# Altium schematic sheet SheetA2.SchDoc
size A2
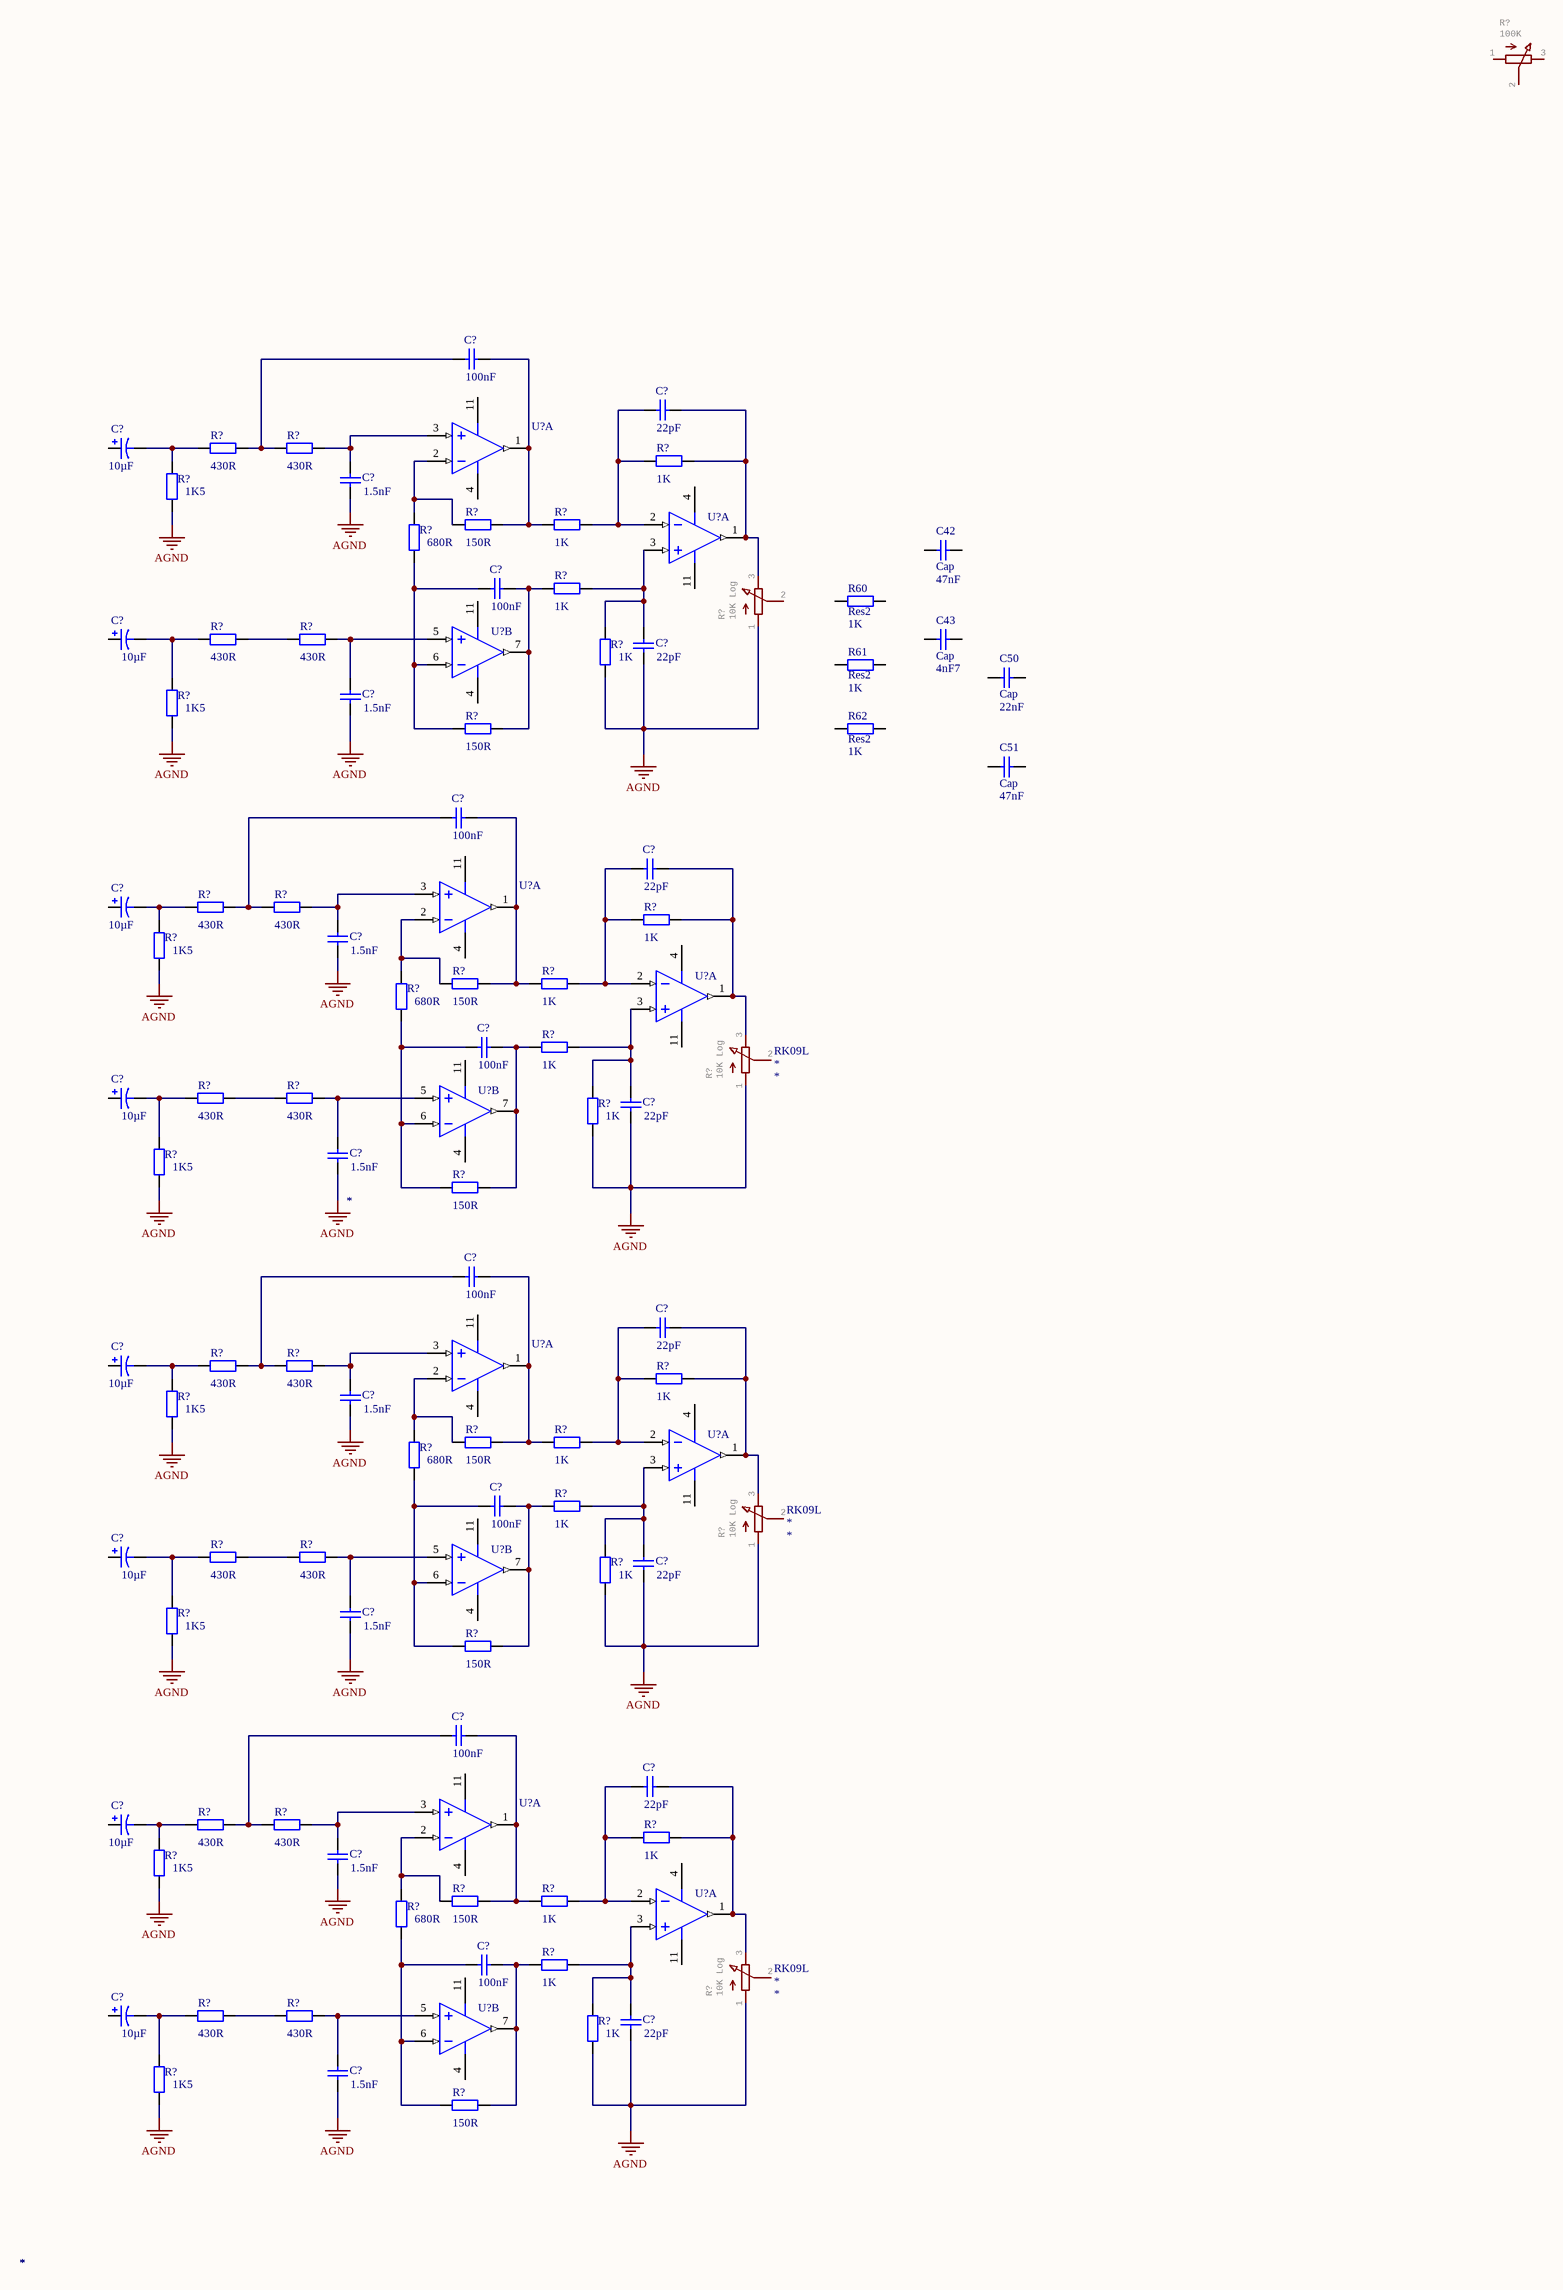
[diagram p0: SheetA2.SchDoc]

## Parts
(Parts that share a designator on the sheet are numbered #1, #2 ... from top to bottom, then left to right.)
C42  Cap  value 47nF  [RAD-0.3]
C43  Cap  value 4nF7  [RAD-0.3]
C50  Cap  value 22nF  [RAD-0.3]
C51  Cap  value 47nF  [RAD-0.3]
C?#1  value 100nF  [RAD-0.3]  (hidden comment: Cap)
C?#2  value 22pF  [RAD-0.3]  (hidden comment: Cap)
C?#3  value 10µF  [RB7.6-15]  (hidden comment: Cap Pol1)
C?#4  value 1.5nF  [RAD-0.3]  (hidden comment: Cap)
C?#5  value 100nF  [RAD-0.3]  (hidden comment: Cap)
C?#6  value 10µF  [RB7.6-15]  (hidden comment: Cap Pol1)
C?#7  value 22pF  [RAD-0.3]  (hidden comment: Cap)
C?#8  value 1.5nF  [RAD-0.3]  (hidden comment: Cap)
C?#9  value 100nF  [RAD-0.3]  (hidden comment: Cap)
C?#10  value 22pF  [RAD-0.3]  (hidden comment: Cap)
C?#11  value 10µF  [RB7.6-15]  (hidden comment: Cap Pol1)
C?#12  value 1.5nF  [RAD-0.3]  (hidden comment: Cap)
C?#13  value 100nF  [RAD-0.3]  (hidden comment: Cap)
C?#14  value 10µF  [RB7.6-15]  (hidden comment: Cap Pol1)
C?#15  value 22pF  [RAD-0.3]  (hidden comment: Cap)
C?#16  value 1.5nF  [RAD-0.3]  (hidden comment: Cap)
C?#17  value 100nF  [RAD-0.3]  (hidden comment: Cap)
C?#18  value 22pF  [RAD-0.3]  (hidden comment: Cap)
C?#19  value 10µF  [RB7.6-15]  (hidden comment: Cap Pol1)
C?#20  value 1.5nF  [RAD-0.3]  (hidden comment: Cap)
C?#21  value 100nF  [RAD-0.3]  (hidden comment: Cap)
C?#22  value 10µF  [RB7.6-15]  (hidden comment: Cap Pol1)
C?#23  value 22pF  [RAD-0.3]  (hidden comment: Cap)
C?#24  value 1.5nF  [RAD-0.3]  (hidden comment: Cap)
C?#25  value 100nF  [RAD-0.3]  (hidden comment: Cap)
C?#26  value 22pF  [RAD-0.3]  (hidden comment: Cap)
C?#27  value 10µF  [RB7.6-15]  (hidden comment: Cap Pol1)
C?#28  value 1.5nF  [RAD-0.3]  (hidden comment: Cap)
C?#29  value 100nF  [RAD-0.3]  (hidden comment: Cap)
C?#30  value 10µF  [RB7.6-15]  (hidden comment: Cap Pol1)
C?#31  value 22pF  [RAD-0.3]  (hidden comment: Cap)
C?#32  value 1.5nF  [RAD-0.3]  (hidden comment: Cap)
R60  Res2  value 1K  [AXIAL-0.4]
R61  Res2  value 1K  [AXIAL-0.4]
R62  Res2  value 1K  [AXIAL-0.4]
R?#1  value 100K  [RK09L1140A5E]
R?#2  value 430R  [AXIAL-0.4]  (hidden comment: Res2)
R?#3  value 430R  [AXIAL-0.4]  (hidden comment: Res2)
R?#4  value 1K  [AXIAL-0.4]  (hidden comment: Res2)
R?#5  value 1K5  [AXIAL-0.4]  (hidden comment: Res2)
R?#6  value 150R  [AXIAL-0.4]  (hidden comment: Res2)
R?#7  value 1K  [AXIAL-0.4]  (hidden comment: Res2)
R?#8  value 680R  [AXIAL-0.4]  (hidden comment: Res2)
R?#9  value 1K  [AXIAL-0.4]  (hidden comment: Res2)
R?#10  value 10K Log  [RK09L1140A5E]
R?#11  value 430R  [AXIAL-0.4]  (hidden comment: Res2)
R?#12  value 430R  [AXIAL-0.4]  (hidden comment: Res2)
R?#13  value 1K  [AXIAL-0.4]  (hidden comment: Res2)
R?#14  value 1K5  [AXIAL-0.4]  (hidden comment: Res2)
R?#15  value 150R  [AXIAL-0.4]  (hidden comment: Res2)
R?#16  value 430R  [AXIAL-0.4]  (hidden comment: Res2)
R?#17  value 430R  [AXIAL-0.4]  (hidden comment: Res2)
R?#18  value 1K  [AXIAL-0.4]  (hidden comment: Res2)
R?#19  value 1K5  [AXIAL-0.4]  (hidden comment: Res2)
R?#20  value 150R  [AXIAL-0.4]  (hidden comment: Res2)
R?#21  value 1K  [AXIAL-0.4]  (hidden comment: Res2)
R?#22  value 680R  [AXIAL-0.4]  (hidden comment: Res2)
R?#23  value 1K  [AXIAL-0.4]  (hidden comment: Res2)
R?#24  value 10K Log  [RK09L1140A5E]
R?#25  value 430R  [AXIAL-0.4]  (hidden comment: Res2)
R?#26  value 430R  [AXIAL-0.4]  (hidden comment: Res2)
R?#27  value 1K  [AXIAL-0.4]  (hidden comment: Res2)
R?#28  value 1K5  [AXIAL-0.4]  (hidden comment: Res2)
R?#29  value 150R  [AXIAL-0.4]  (hidden comment: Res2)
R?#30  value 430R  [AXIAL-0.4]  (hidden comment: Res2)
R?#31  value 430R  [AXIAL-0.4]  (hidden comment: Res2)
R?#32  value 1K  [AXIAL-0.4]  (hidden comment: Res2)
R?#33  value 1K5  [AXIAL-0.4]  (hidden comment: Res2)
R?#34  value 150R  [AXIAL-0.4]  (hidden comment: Res2)
R?#35  value 1K  [AXIAL-0.4]  (hidden comment: Res2)
R?#36  value 680R  [AXIAL-0.4]  (hidden comment: Res2)
R?#37  value 1K  [AXIAL-0.4]  (hidden comment: Res2)
R?#38  value 10K Log  [RK09L1140A5E]
R?#39  value 430R  [AXIAL-0.4]  (hidden comment: Res2)
R?#40  value 430R  [AXIAL-0.4]  (hidden comment: Res2)
R?#41  value 1K  [AXIAL-0.4]  (hidden comment: Res2)
R?#42  value 1K5  [AXIAL-0.4]  (hidden comment: Res2)
R?#43  value 150R  [AXIAL-0.4]  (hidden comment: Res2)
R?#44  value 430R  [AXIAL-0.4]  (hidden comment: Res2)
R?#45  value 430R  [AXIAL-0.4]  (hidden comment: Res2)
R?#46  value 1K  [AXIAL-0.4]  (hidden comment: Res2)
R?#47  value 1K5  [AXIAL-0.4]  (hidden comment: Res2)
R?#48  value 150R  [AXIAL-0.4]  (hidden comment: Res2)
R?#49  value 1K  [AXIAL-0.4]  (hidden comment: Res2)
R?#50  value 680R  [AXIAL-0.4]  (hidden comment: Res2)
R?#51  value 1K  [AXIAL-0.4]  (hidden comment: Res2)
R?#52  value 10K Log  [RK09L1140A5E]
R?#53  value 430R  [AXIAL-0.4]  (hidden comment: Res2)
R?#54  value 430R  [AXIAL-0.4]  (hidden comment: Res2)
R?#55  value 1K  [AXIAL-0.4]  (hidden comment: Res2)
R?#56  value 1K5  [AXIAL-0.4]  (hidden comment: Res2)
R?#57  value 150R  [AXIAL-0.4]  (hidden comment: Res2)
U?#1  OPA1664AIDR  [D0014A_L]  (value not drawn)  (part A of 4)
U?#2  OPA1664AIDR  [D0014A_L]  (value not drawn)  (part A of 4)
U?#3  OPA1664AIDR  [D0014A_L]  (value not drawn)  (part B of 4)
U?#4  OPA1664AIDR  [D0014A_L]  (value not drawn)  (part A of 4)
U?#5  OPA1664AIDR  [D0014A_L]  (value not drawn)  (part A of 4)
U?#6  OPA1664AIDR  [D0014A_L]  (value not drawn)  (part B of 4)
U?#7  OPA1664AIDR  [D0014A_L]  (value not drawn)  (part A of 4)
U?#8  OPA1664AIDR  [D0014A_L]  (value not drawn)  (part A of 4)
U?#9  OPA1664AIDR  [D0014A_L]  (value not drawn)  (part B of 4)
U?#10  OPA1664AIDR  [D0014A_L]  (value not drawn)  (part A of 4)
U?#11  OPA1664AIDR  [D0014A_L]  (value not drawn)  (part A of 4)
U?#12  OPA1664AIDR  [D0014A_L]  (value not drawn)  (part B of 4)

## Nets
AGND: C?#4.1 C?#7.1 C?#8.1 C?#12.1 C?#15.1 C?#16.1 C?#20.1 C?#23.1 C?#24.1 C?#28.1 C?#31.1 C?#32.1 R?#5.1 R?#10.1 R?#13.1 R?#14.1 R?#19.1 R?#24.1 R?#27.1 R?#28.1 R?#33.1 R?#38.1 R?#41.1 R?#42.1 R?#47.1 R?#52.1 R?#55.1 R?#56.1
NetC?#1_1: C?#1.1 R?#2.2 R?#3.1
NetC?#1_2: C?#1.2 R?#6.2 R?#7.1 U?#1.1(OUT_A)
NetC?#2_1: C?#2.1 R?#4.1 R?#7.2 U?#2.2(IN_A-)
NetC?#2_2: C?#2.2 R?#4.2 R?#10.3 U?#2.1(OUT_A)
NetC?#3_2: C?#3.2 R?#2.1 R?#5.2
NetC?#4_2: C?#4.2 R?#3.2 U?#1.3(IN_A+)
NetC?#5_1: C?#5.1 R?#8.1 R?#15.1 U?#3.6(IN_B-)
NetC?#5_2: C?#5.2 R?#9.1 R?#15.2 U?#3.7(OUT_B)
NetC?#6_2: C?#6.2 R?#11.1 R?#14.2
NetC?#7_2: C?#7.2 R?#9.2 R?#13.2 U?#2.3(IN_A+)
NetC?#8_2: C?#8.2 R?#12.2 U?#3.5(IN_B+)
NetC?#9_1: C?#9.1 R?#16.2 R?#17.1
NetC?#9_2: C?#9.2 R?#20.2 R?#21.1 U?#4.1(OUT_A)
NetC?#10_1: C?#10.1 R?#18.1 R?#21.2 U?#5.2(IN_A-)
NetC?#10_2: C?#10.2 R?#18.2 R?#24.3 U?#5.1(OUT_A)
NetC?#11_2: C?#11.2 R?#16.1 R?#19.2
NetC?#12_2: C?#12.2 R?#17.2 U?#4.3(IN_A+)
NetC?#13_1: C?#13.1 R?#22.1 R?#29.1 U?#6.6(IN_B-)
NetC?#13_2: C?#13.2 R?#23.1 R?#29.2 U?#6.7(OUT_B)
NetC?#14_2: C?#14.2 R?#25.1 R?#28.2
NetC?#15_2: C?#15.2 R?#23.2 R?#27.2 U?#5.3(IN_A+)
NetC?#16_2: C?#16.2 R?#26.2 U?#6.5(IN_B+)
NetC?#17_1: C?#17.1 R?#30.2 R?#31.1
NetC?#17_2: C?#17.2 R?#34.2 R?#35.1 U?#7.1(OUT_A)
NetC?#18_1: C?#18.1 R?#32.1 R?#35.2 U?#8.2(IN_A-)
NetC?#18_2: C?#18.2 R?#32.2 R?#38.3 U?#8.1(OUT_A)
NetC?#19_2: C?#19.2 R?#30.1 R?#33.2
NetC?#20_2: C?#20.2 R?#31.2 U?#7.3(IN_A+)
NetC?#21_1: C?#21.1 R?#36.1 R?#43.1 U?#9.6(IN_B-)
NetC?#21_2: C?#21.2 R?#37.1 R?#43.2 U?#9.7(OUT_B)
NetC?#22_2: C?#22.2 R?#39.1 R?#42.2
NetC?#23_2: C?#23.2 R?#37.2 R?#41.2 U?#8.3(IN_A+)
NetC?#24_2: C?#24.2 R?#40.2 U?#9.5(IN_B+)
NetC?#25_1: C?#25.1 R?#44.2 R?#45.1
NetC?#25_2: C?#25.2 R?#48.2 R?#49.1 U?#10.1(OUT_A)
NetC?#26_1: C?#26.1 R?#46.1 R?#49.2 U?#11.2(IN_A-)
NetC?#26_2: C?#26.2 R?#46.2 R?#52.3 U?#11.1(OUT_A)
NetC?#27_2: C?#27.2 R?#44.1 R?#47.2
NetC?#28_2: C?#28.2 R?#45.2 U?#10.3(IN_A+)
NetC?#29_1: C?#29.1 R?#50.1 R?#57.1 U?#12.6(IN_B-)
NetC?#29_2: C?#29.2 R?#51.1 R?#57.2 U?#12.7(OUT_B)
NetC?#30_2: C?#30.2 R?#53.1 R?#56.2
NetC?#31_2: C?#31.2 R?#51.2 R?#55.2 U?#11.3(IN_A+)
NetC?#32_2: C?#32.2 R?#54.2 U?#12.5(IN_B+)
NetR?#6_1: R?#6.1 R?#8.2 U?#1.2(IN_A-)
NetR?#11_2: R?#11.2 R?#12.1
NetR?#20_1: R?#20.1 R?#22.2 U?#4.2(IN_A-)
NetR?#25_2: R?#25.2 R?#26.1
NetR?#34_1: R?#34.1 R?#36.2 U?#7.2(IN_A-)
NetR?#39_2: R?#39.2 R?#40.1
NetR?#48_1: R?#48.1 R?#50.2 U?#10.2(IN_A-)
NetR?#53_2: R?#53.2 R?#54.1

Not connected (* = marked no-connect by the designer): C42 1 2; C43 1 2; C50 1 2; C51 1 2; C?#3 1; C?#6 1; C?#11 1; C?#14 1; C?#19 1; C?#22 1; C?#27 1; C?#30 1; R60 1 2; R61 1 2; R62 1 2; R?#1 1 2 3; R?#10 2; R?#24 2; R?#38 2; R?#52 2; U?#1 4(V+) 11(V-); U?#2 4(V+) 11(V-); U?#3 4(V+) 11(V-); U?#4 4(V+) 11(V-); U?#5 4(V+) 11(V-); U?#6 4(V+) 11(V-); U?#7 4(V+) 11(V-); U?#8 4(V+) 11(V-); U?#9 4(V+) 11(V-); U?#10 4(V+) 11(V-); U?#11 4(V+) 11(V-); U?#12 4(V+) 11(V-)

## Library data of the parts
C42 C43 C50 C51 C?#1 C?#2 C?#4 C?#5 C?#7-C?#10 C?#12 C?#13 C?#15-C?#18 C?#20 C?#21 C?#23-C?#26 C?#28 C?#29 C?#31 C?#32 = Cap: Capacitor; Published: 8-Jun-2000; LatestRevisionDate: 17-Jul-2002; LatestRevisionNote: Re-released for DXP Platform.; PackageReference: RAD-0.3; Publisher: Altium Limited; PackageDescription: Radial Cap, Thru-Hole; 2 Leads; 0.3 in Pin Spacing
C?#3 C?#6 C?#11 C?#14 C?#19 C?#22 C?#27 C?#30 = Cap Pol1: Polarized Capacitor (Radial); Published: 8-Jun-2000; LatestRevisionDate: 17-Jul-2002; LatestRevisionNote: Re-released for DXP Platform.; PackageReference: RB7.6-15; Publisher: Altium Limited; PackageDescription: Polarized Capacitor (Radial); 2 Leads
R60-R62 R?#2-R?#9 R?#11-R?#23 R?#25-R?#37 R?#39-R?#51 R?#53-R?#57 = Res2: Resistor; Published: 8-Jun-2000; LatestRevisionDate: 17-Jul-2002; LatestRevisionNote: Re-released for DXP Platform.; PackageReference: AXIAL-0.4; Publisher: Altium Limited; PackageDescription: Axial Device, Thru-Hole; 2 Leads; 0.4 in Pin Spacing
R?#1 R?#10 R?#24 R?#38 R?#52 = RK09L: GateName_1: G$1; SymbolName_1: POT_EU-; LibraryName: SD_Pots; DeviceSetName: RK09L
U?#1-U?#12 = CMP-0272-00211-3: Sound Plus Low-Power, Low-Noise and Distortion, Audio Operational Amplifier, 3 to 36 V, -40 to 85 degC, 14-pin SOIC (D14), Green (RoHS & no Sb/Br); Manufacturer: Texas Instruments; Iq per channel(Max)(mA): 1.5; IIB(Max)(pA): 1200000; Offset Drift(Typ)(uV/C): 2; Total Supply Voltage(Max)(+5V is 5, +/-5V is 10): 36; Rating: Catalog; Packing: LARGE T&R; Slew Rate(Typ)(V/us): 17; CMRR(Min)(dB): 106; Total Supply Voltage(Min)(+5V is 5, +/-5V is 10): 3; Sub Family: Audio Operational Amplifier, High Supply Voltage Amplifier (>=30V), Low Noise Amp (<=10nV/rtHz), Precision Amplifier; GBW(Typ)(MHz): 22; Number of Channels: 4; Code_JEDEC: MS-012; PartNumber: OPA1664AIDR; ComponentLink2Description: Datasheet; ComponentLink3URL: http://www.ti.com/lit/ml/mpds177g/mpds177g.pdf; PackageVersion: 4040047-5/M, 06/2011; ComponentLink1Description: Manufacturer URL; DatasheetVersion: SBOS489; Mounting Technology: Surface Mount; Vio (25C)(Max)(mV): 1.5; PackageReference: D0014A; ComponentLink1URL: http://www.ti.com/; ComponentLink2URL: http://www.ti.com/lit/ds/symlink/opa1664.pdf; Eco-Plan: Green (RoHS & no Sb/Br); PackageDescription: 14-Pin Plastic Small Outline, Body 8.65 x 3.9 mm, Pitch 1.27 mm; ComponentLink3Description: Package Specification